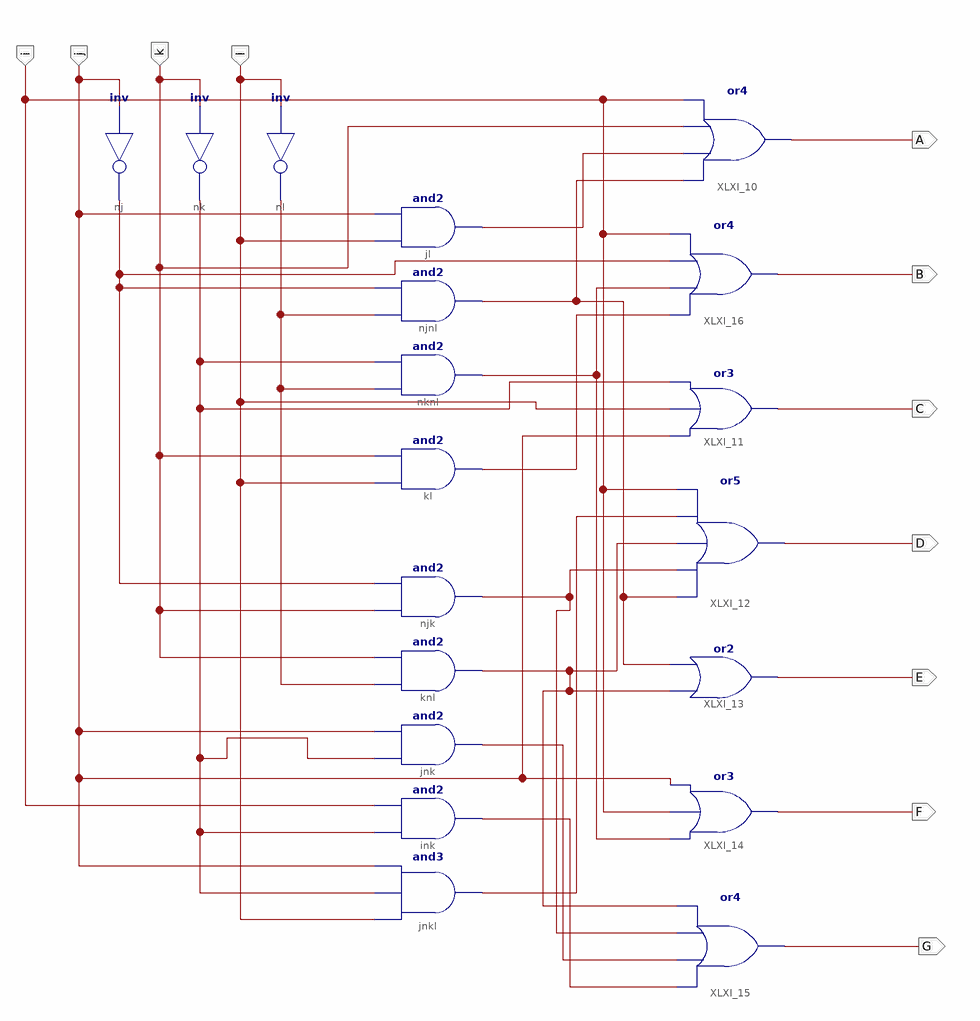
[diagram p0: schematic sheet 1]
// Xilinx ISE schematic bcdto7segment.sch (spartan6) as structural Verilog: 19 symbols, 11 ports
module bcdto7segment (
  input  l,
  input  k,
  input  j,
  input  i,
  output A,
  output B,
  output C,
  output D,
  output E,
  output F,
  output G
);

  wire XLXN_8, XLXN_52, XLXN_55, XLXN_59, XLXN_62, XLXN_65, XLXN_70, XLXN_77, XLXN_87, XLXN_88, XLXN_89,
       XLXN_90;

  not nj (XLXN_77, j);
  not nk (XLXN_8, k);
  not nl (XLXN_90, l);
  and jl (XLXN_52, l, j);
  and njnl (XLXN_88, XLXN_90, XLXN_77);
  and nknl (XLXN_55, XLXN_90, XLXN_8);
  and njk (XLXN_62, k, XLXN_77);
  and jnk (XLXN_89, XLXN_8, j);
  and ink (XLXN_70, XLXN_8, i);
  or XLXI_10 (A, XLXN_88, XLXN_52, k, i);
  or XLXI_11 (C, j, l, XLXN_8);
  or XLXI_12 (D, XLXN_88, XLXN_62, XLXN_65, XLXN_59, i);
  or XLXI_13 (E, XLXN_65, XLXN_88);
  or XLXI_14 (F, XLXN_55, i, j);
  or XLXI_15 (G, XLXN_70, XLXN_89, XLXN_62, XLXN_65);
  or XLXI_16 (B, XLXN_87, XLXN_55, XLXN_77, i);
  and kl (XLXN_87, l, k);
  and knl (XLXN_65, XLXN_90, k);
  and jnkl (XLXN_59, l, XLXN_8, j);
endmodule
